# EAGLE design 8565_adapter (EAGLE 9.2.2)
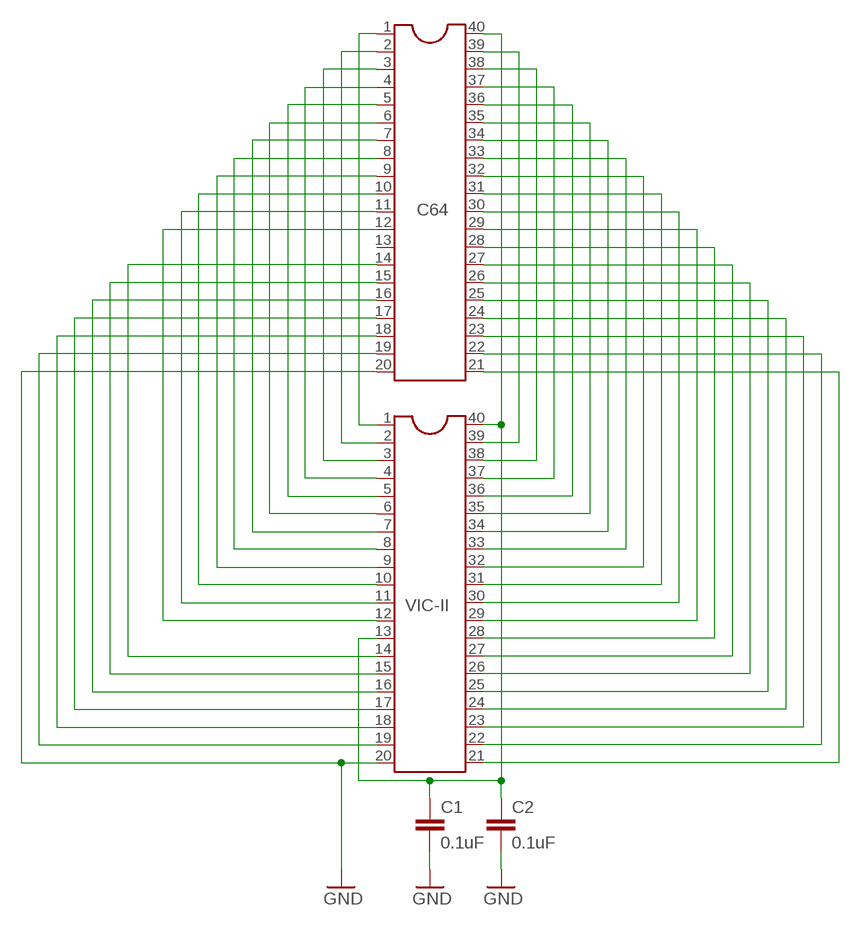
[diagram p0: schematic, sheet 1]

## Parts
C1  0.1uF  CAP0603-CAP  [0603-CAP]
C2  0.1uF  CAPEZ  [CAP-PTH-SMALLEZ]
C64  DIL40NO_SILK  [DIL40-TINY]
VIC-II  DIL40  [DIL40]

## Nets
GND: C1.2 C2.2 C64.20 VIC-II.20
N$1: C1.1 C2.1 C64.40 VIC-II.13 VIC-II.40
N$2: C64.39 VIC-II.39
N$3: C64.38 VIC-II.38
N$4: C64.37 VIC-II.37
N$5: C64.36 VIC-II.36
N$6: C64.35 VIC-II.35
N$7: C64.34 VIC-II.34
N$8: C64.33 VIC-II.33
N$9: C64.32 VIC-II.32
N$10: C64.31 VIC-II.31
N$11: C64.30 VIC-II.30
N$12: C64.29 VIC-II.29
N$13: C64.28 VIC-II.28
N$14: C64.27 VIC-II.27
N$15: C64.26 VIC-II.26
N$16: C64.25 VIC-II.25
N$17: C64.24 VIC-II.24
N$18: C64.23 VIC-II.23
N$19: C64.22 VIC-II.22
N$20: C64.21 VIC-II.21
N$22: C64.2 VIC-II.2
N$23: C64.3 VIC-II.3
N$24: C64.4 VIC-II.4
N$25: C64.5 VIC-II.5
N$26: C64.6 VIC-II.6
N$27: C64.7 VIC-II.7
N$28: C64.8 VIC-II.8
N$29: C64.9 VIC-II.9
N$30: C64.10 VIC-II.10
N$31: C64.11 VIC-II.11
N$32: C64.12 VIC-II.12
N$33: C64.14 VIC-II.14
N$34: C64.15 VIC-II.15
N$35: C64.16 VIC-II.16
N$36: C64.17 VIC-II.17
N$37: C64.18 VIC-II.18
N$38: C64.19 VIC-II.19
N$40: C64.1 VIC-II.1
Unconnected: C64.13

## Library data of the parts
C1 C2 = SparkFun-Capacitors:CAP: Capacitor Standard 0603 ceramic capacitor, and 0.1" leaded capacitor.
C64 VIC-II = rakettitiede:DIL40: Dual In Line

## Board
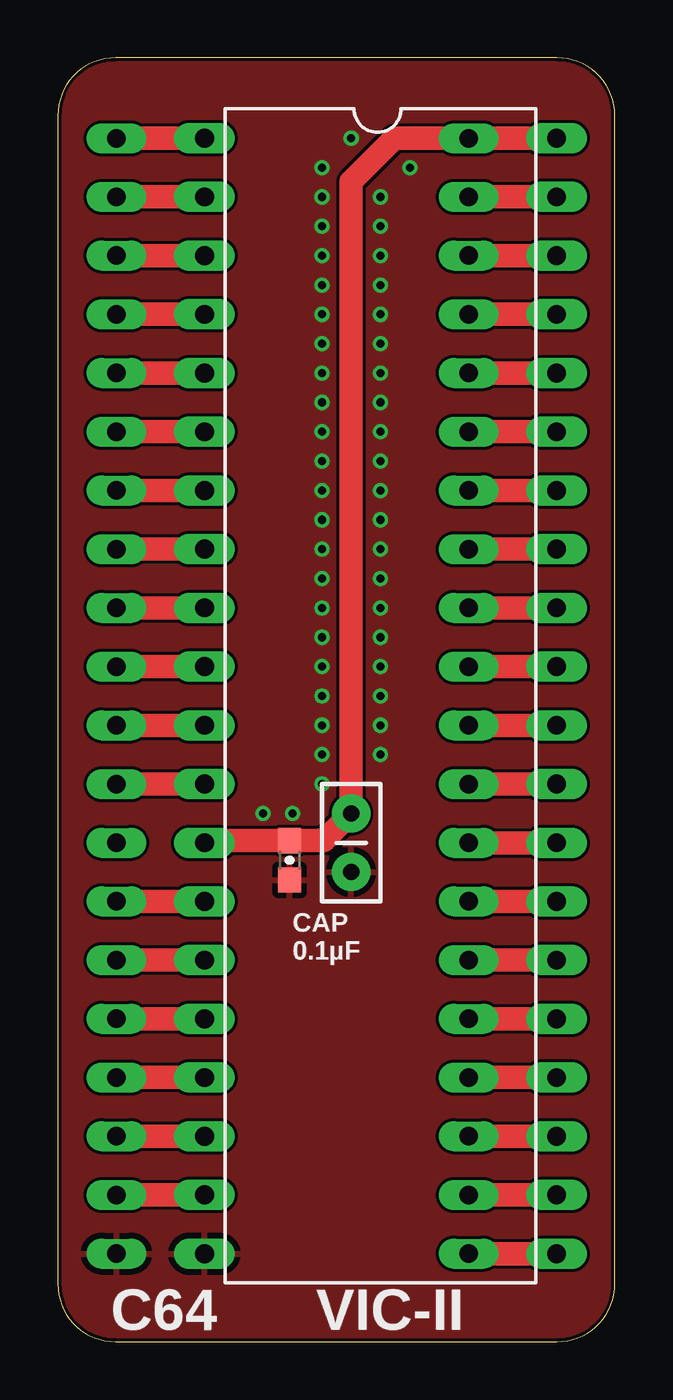
[diagram p1: board, top side]
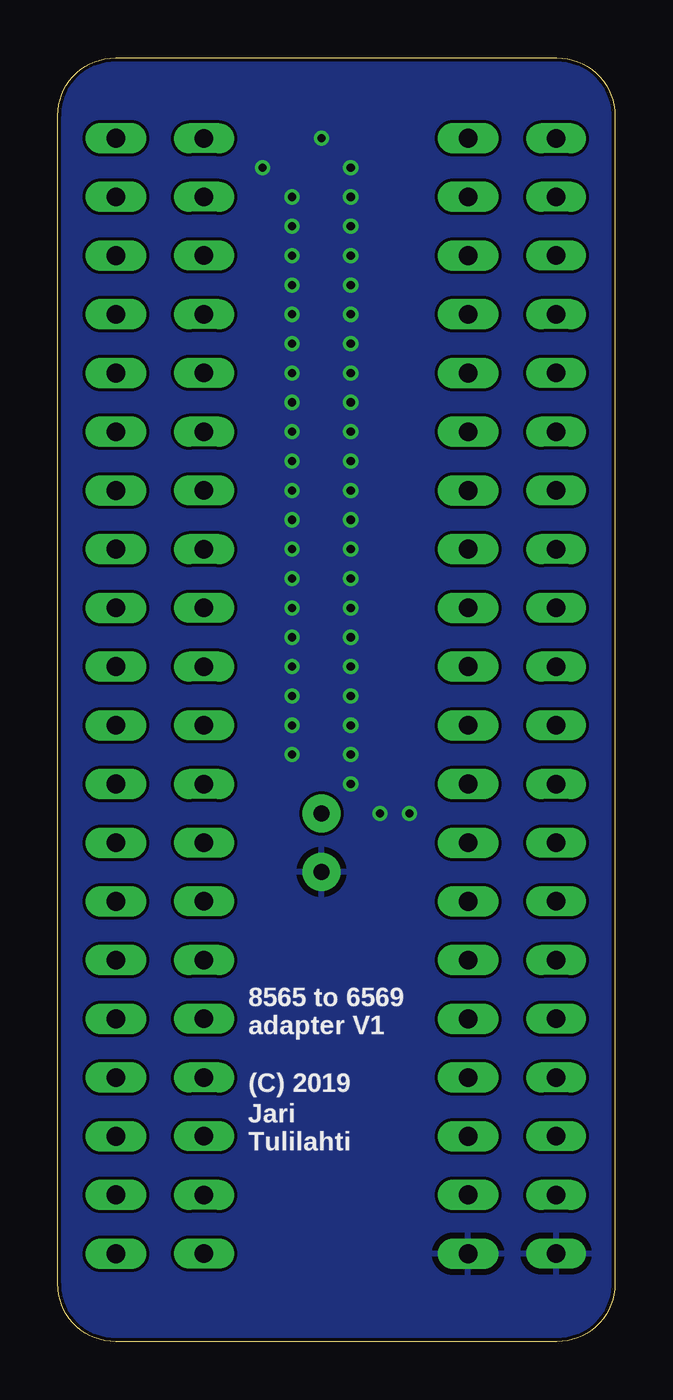
[diagram p2: board, bottom side, seen from below]

Size 24.11 x 55.55 mm. Coordinates in mm from the lower left corner, seen from the top.
Outline: 0,53.05 0,2.5 arc90 2.5,0 21.61,0 arc90 24.11,2.5 24.11,53.05 arc90 21.61,55.55 2.5,55.55 arc90 0,53.05
Copper layers (1*16): Top 0.035mm / dielectric 1.5mm / Bottom 0.035mm
Design rules "hackvana_5mil": minimum track width 6mil, minimum drill 0.3mm, track to track 5mil, track to pad 5mil, pad to pad 5mil, via to via 5mil, smd to smd 0mil, copper to edge 6mil, drill to drill 6mil, minimum pad ring 10mil, minimum via ring 6mil, stop-mask expansion 2mil, vias tented up to drill 100mil, thermal gap 10mil

### Footprints (pad centres in the part's own frame; a part is rotated, then mirrored left to right if it is on the bottom)
0603-CAP = smd 1.1 x 1: 1 -0.85,0; 2 0.85,0
CAP-PTH-SMALLEZ = drill 0.7 pad 1.651: 1 0,0; 2 2.54,0
DIL40-TINY = drill 0.8 long: 1 -24.13,-7.62; 2 -21.59,-7.62; 3 -19.05,-7.62; 4 -16.51,-7.62; 5 -13.97,-7.62; 6 -11.43,-7.62; 7 -8.89,-7.62; 8 -6.35,-7.62; 9 -3.81,-7.62; 10 -1.27,-7.62; 11 1.27,-7.62; 12 3.81,-7.62; 13 6.35,-7.62; 14 8.89,-7.62; 15 11.43,-7.62; 16 13.97,-7.62; 17 16.51,-7.62; 18 19.05,-7.62; 19 21.59,-7.62; 20 24.13,-7.62; 21 24.13,7.62; 22 21.59,7.62; 23 19.05,7.62; 24 16.51,7.62; 25 13.97,7.62; 26 11.43,7.62; 27 8.89,7.62; 28 6.35,7.62; 29 3.81,7.62; 30 1.27,7.62; 31 -1.27,7.62; 32 -3.81,7.62; 33 -6.35,7.62; 34 -8.89,7.62; 35 -11.43,7.62; 36 -13.97,7.62; 37 -16.51,7.62; 38 -19.05,7.62; 39 -21.59,7.62; 40 -24.13,7.62
DIL40 = drill 0.813 long: 1 -24.13,-7.62; 2 -21.59,-7.62; 3 -19.05,-7.62; 4 -16.51,-7.62; 5 -13.97,-7.62; 6 -11.43,-7.62; 7 -8.89,-7.62; 8 -6.35,-7.62; 9 -3.81,-7.62; 10 -1.27,-7.62; 11 1.27,-7.62; 12 3.81,-7.62; 13 6.35,-7.62; 14 8.89,-7.62; 15 11.43,-7.62; 16 13.97,-7.62; 17 16.51,-7.62; 18 19.05,-7.62; 19 21.59,-7.62; 20 24.13,-7.62; 21 24.13,7.62; 22 21.59,7.62; 23 19.05,7.62; 24 16.51,7.62; 25 13.97,7.62; 26 11.43,7.62; 27 8.89,7.62; 28 6.35,7.62; 29 3.81,7.62; 30 1.27,7.62; 31 -1.27,7.62; 32 -3.81,7.62; 33 -6.35,7.62; 34 -8.89,7.62; 35 -11.43,7.62; 36 -13.97,7.62; 37 -16.51,7.62; 38 -19.05,7.62; 39 -21.59,7.62; 40 -24.13,7.62

### Placement (x,y rotation side)
C1  10.03,20.83 270 top
C2  12.7,22.86 270 top
C64  10.16,27.94 270 top
VIC-II  13.97,27.94 270 top

### Tracks (layer width: path | path; a pad name or v marks a point on that pad's centre or on a via)
GND  (via drill 0.35)
  other vias: 8.89,22.86 10.16,22.86 11.43,24.13 11.43,25.4 11.43,26.67 11.43,27.94 11.43,29.21 11.43,30.48 11.43,31.75 11.43,33.02 11.43,34.29 11.43,35.56 11.43,36.83 11.43,38.1 11.43,39.37 11.43,40.64 11.43,41.91 11.43,43.18 11.43,44.45 11.43,45.72 11.43,46.99 11.43,48.26 11.43,49.53 11.43,50.8 12.7,52.07 15.24,50.8 13.97,49.53 13.97,48.26 13.97,46.99 13.97,45.72 13.97,44.45 13.97,43.18 13.97,41.91 13.97,40.64 13.97,39.37 13.97,38.1 13.97,36.83 13.97,35.56 13.97,34.29 13.97,33.02 13.97,31.75 13.97,30.48 13.97,29.21 13.97,27.94 13.97,26.67 13.97,25.4
  pour Top: 0,0 0,55.88 24.13,55.88 24.13,0
  pour Bottom: 0,0 0,55.88 24.13,55.88 24.13,0
N$1
  Top 1.016: VIC-II.13 6.44,21.68 C1.1 11.52,21.68 C2.1 12.7,50.2 14.57,52.07 C64.40 VIC-II.40
N$2
  Top 1.016: VIC-II.39 C64.39
N$3
  Top 1.016: VIC-II.38 C64.38
N$4
  Top 1.016: VIC-II.37 C64.37
N$5
  Top 1.016: VIC-II.36 C64.36
N$6
  Top 1.016: VIC-II.35 C64.35
N$7
  Top 1.016: VIC-II.34 C64.34
N$8
  Top 1.016: VIC-II.33 C64.33
N$9
  Top 1.016: VIC-II.32 C64.32
N$10
  Top 1.016: VIC-II.31 C64.31
N$11
  Top 1.016: VIC-II.30 C64.30
N$12
  Top 1.016: VIC-II.29 C64.29
N$13
  Top 1.016: VIC-II.28 C64.28
N$14
  Top 1.016: VIC-II.27 C64.27
N$15
  Top 1.016: VIC-II.26 C64.26
N$16
  Top 1.016: VIC-II.25 C64.25
N$17
  Top 1.016: VIC-II.24 C64.24
N$18
  Top 1.016: VIC-II.23 C64.23
N$19
  Top 1.016: VIC-II.22 C64.22
N$20
  Top 1.016: C64.21 VIC-II.21
N$22
  Top 1.016: VIC-II.2 C64.2
N$23
  Top 1.016: C64.3 VIC-II.3
N$24
  Top 1.016: VIC-II.4 C64.4
N$25
  Top 1.016: C64.5 VIC-II.5
N$26
  Top 1.016: C64.6 VIC-II.6
N$27
  Top 1.016: VIC-II.7 C64.7
N$28
  Top 1.016: C64.8 VIC-II.8
N$29
  Top 1.016: VIC-II.9 C64.9
N$30
  Top 1.016: C64.10 VIC-II.10
N$31
  Top 1.016: VIC-II.11 C64.11
N$32
  Top 1.016: VIC-II.12 C64.12
N$33
  Top 1.016: C64.14 VIC-II.14
N$34
  Top 1.016: VIC-II.15 C64.15
N$35
  Top 1.016: C64.16 VIC-II.16
N$36
  Top 1.016: VIC-II.17 C64.17
N$37
  Top 1.016: VIC-II.18 C64.18
N$38
  Top 1.016: C64.19 VIC-II.19
N$40
  Top 1.016: VIC-II.1 C64.1

### Text on the board
tPlace: CAP / 0.1µF
bPlace: 8565 to 6569 / adapter V1 | (C) 2019 | Jari / Tulilahti